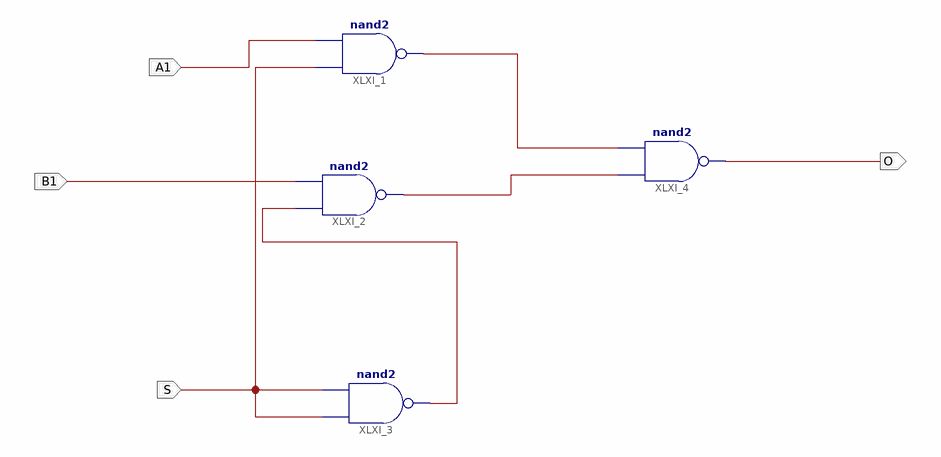
[diagram p0: schematic sheet 1]
// Xilinx ISE schematic Experiment5.sch (spartan3e) as structural Verilog: 4 symbols, 4 ports
module Experiment5 (
  input  A1,
  input  B1,
  input  S,
  output O
);

  wire XLXN_1, XLXN_2, XLXN_3;

  nand XLXI_1 (XLXN_3, S, A1);
  nand XLXI_2 (XLXN_2, XLXN_1, B1);
  nand XLXI_3 (XLXN_1, S, S);
  nand XLXI_4 (O, XLXN_2, XLXN_3);
endmodule
